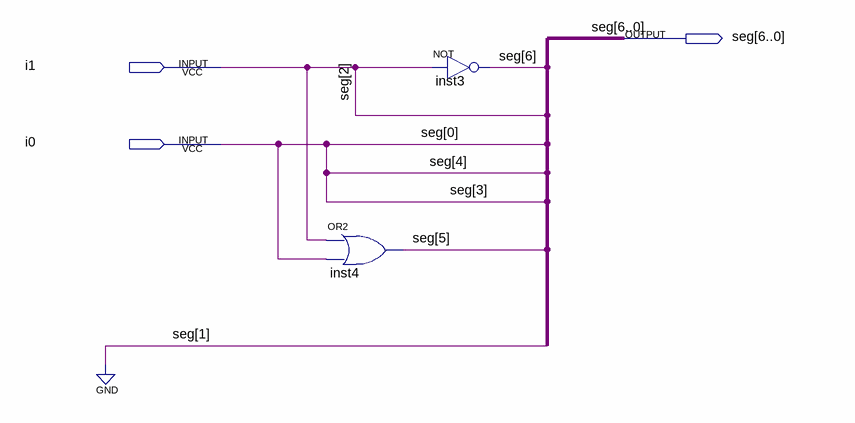
[diagram p0: schematic sheet]
// Quartus schematic msb+veresult.bdf as structural Verilog: 2 symbols, 3 pins
module \msb+veresult  (
  input  i1,
  input  i0,
  output [6:0] seg
);

  or inst4 (seg[5], i1, i0);
  not inst3 (seg[6], i1);

  assign seg[4:0] = {{2{i0}}, i1, 1'b0, i0};
endmodule
